# Altium schematic sheet Jellyfish - LCD.SchDoc
size A
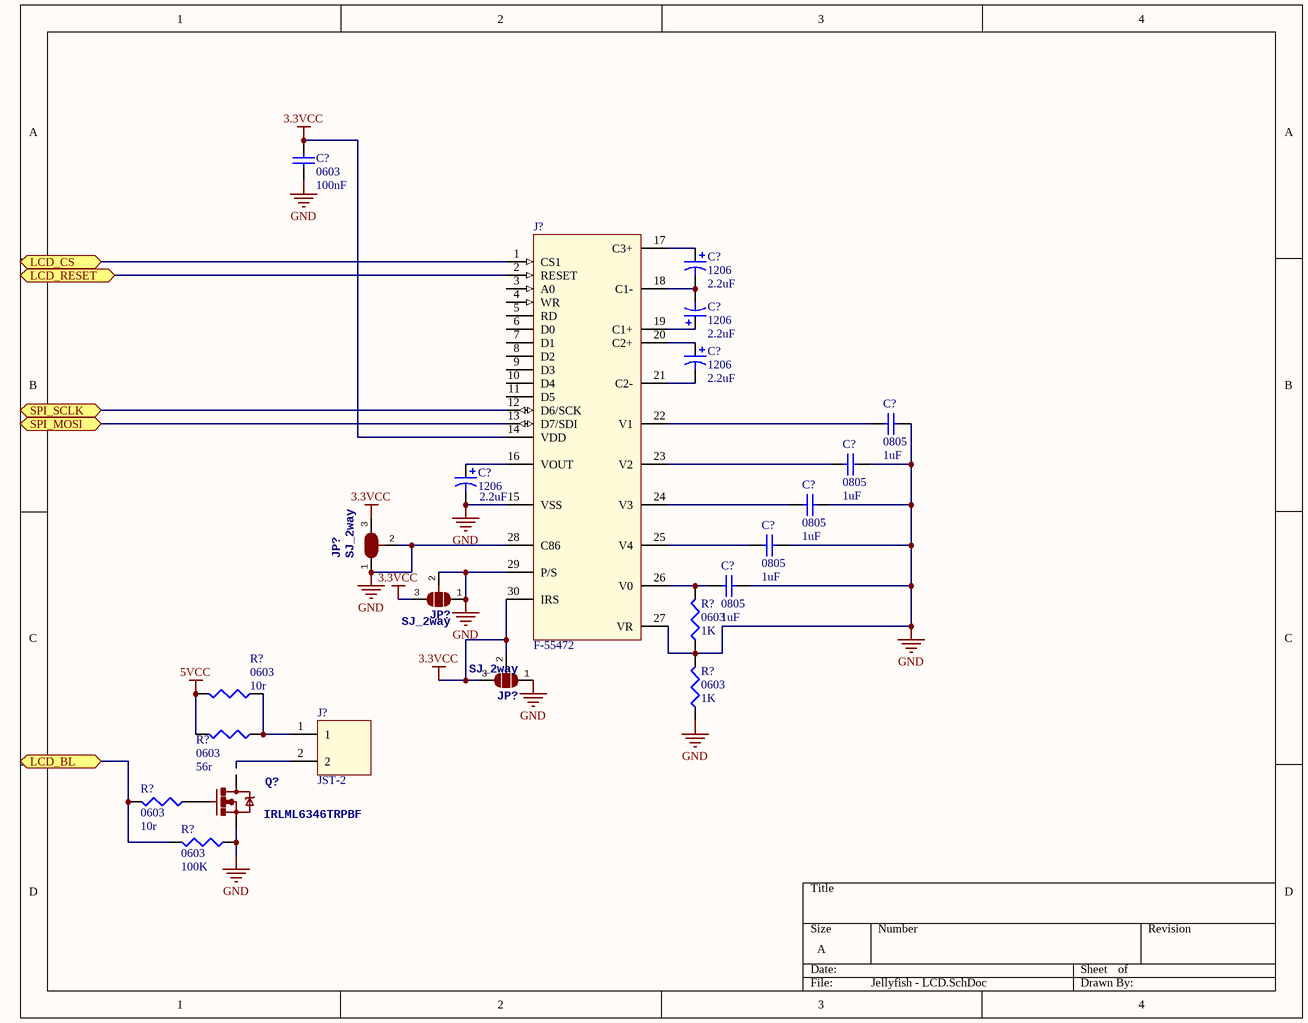
[diagram p0: Jellyfish - LCD.SchDoc]

## Parts
(Parts that share a designator on the sheet are numbered #1, #2 ... from top to bottom, then left to right.)
C?#1  0603  value 100nF  [1608[0603]]
C?#2  1206  value 2.2uF  [C1206Tantalum]
C?#3  1206  value 2.2uF  [C1206Tantalum]
C?#4  1206  value 2.2uF  [C1206Tantalum]
C?#5  0805  value 1uF  [SM 0805 - gap trimmed]
C?#6  0805  value 1uF  [SM 0805 - gap trimmed]
C?#7  1206  value 2.2uF  [C1206Tantalum]
C?#8  0805  value 1uF  [SM 0805 - gap trimmed]
C?#9  0805  value 1uF  [SM 0805 - gap trimmed]
C?#10  0805  value 1uF  [SM 0805 - gap trimmed]
J?#1  F-55472  [10051922-3010ELF]
J?#2  JST-2  [JST-2]
JP?#1  SJ_2way  [SJ-2way]
JP?#2  SJ_2way  [SJ-2way]
JP?#3  SJ_2way  [SJ-2way]
Q?  IRLML6346TRPBF  [SOT23-3]
R?#1  0603  value 1K  [J1-0603]
R?#2  0603  value 10r  [J1-0603]
R?#3  0603  value 1K  [J1-0603]
R?#4  0603  value 56r  [J1-0603]
R?#5  0603  value 10r  [J1-0603]
R?#6  0603  value 100K  [J1-0603]

## Ports
LCD_BL, LCD_CS, LCD_RESET, SPI_MOSI, SPI_SCLK

## Nets
3.3VCC: C?#1.2 J?#1.14(VDD) J?#1.30(IRS) JP?#1.3 JP?#2.3 JP?#3.2 JP?#3.3
5VCC: R?#2.2 R?#4.2
GND: C?#1.1 C?#5.2 C?#6.2 C?#7.2 C?#8.2 C?#9.2 C?#10.2 J?#1.15(VSS) J?#1.27(VR) J?#1.28(C86) J?#1.29(P/S) JP?#1.1 JP?#1.2 JP?#2.1 JP?#2.2 JP?#3.1 Q?.2(S) R?#1.1 R?#3.1 R?#3.2 R?#6.1
LCD_BL: R?#5.2 R?#6.2 ; port LCD_BL
LCD_CS: J?#1.1(CS1) ; port LCD_CS
LCD_RESET: J?#1.2(RESET) ; port LCD_RESET
SPI_MOSI: J?#1.13(D7/SDI) ; port SPI_MOSI
SPI_SCLK: J?#1.12(D6/SCK) ; port SPI_SCLK
NetC?#2_1: C?#2.1 J?#1.17(C3+)
NetC?#2_2: C?#2.2 C?#3.2 J?#1.18(C1-)
NetC?#3_1: C?#3.1 J?#1.19(C1+)
NetC?#4_1: C?#4.1 J?#1.20(C2+)
NetC?#4_2: C?#4.2 J?#1.21(C2-)
NetC?#5_1: C?#5.1 J?#1.22(V1)
NetC?#6_1: C?#6.1 J?#1.23(V2)
NetC?#7_1: C?#7.1 J?#1.16(VOUT)
NetC?#8_1: C?#8.1 J?#1.24(V3)
NetC?#9_1: C?#9.1 J?#1.25(V4)
NetC?#10_1: C?#10.1 J?#1.26(V0) R?#1.2
NetJ?#2_1: J?#2.1 R?#2.1 R?#4.1
NetQ?_1: Q?.1(G) R?#5.1

Not connected (* = marked no-connect by the designer): J?#1 3(A0) 4(WR) 5(RD) 6(D0) 7(D1) 8(D2) 9(D3) 10(D4) 11(D5); J?#2 2; Q? 3(D)

## Library data of the parts
C?#1 C?#5 C?#6 C?#8-C?#10 = Cap Semi: Capacitor (Semiconductor SIM Model); Published: 8-Jun-2000; LatestRevisionDate: 29-May-2009; LatestRevisionNote: IPC-7351 Footprint Added.; PackageReference: C1206; Publisher: Altium Limited; PackageDescription: Chip Capacitor
C?#2-C?#4 C?#7 = Cap Pol3: Polarized Capacitor (Surface Mount); Published: 8-Jun-2000; LatestRevisionDate: 29-May-2009; LatestRevisionNote: IPC-7351 Footprint Added.; PackageReference: C0805; Publisher: Altium Limited; PackageDescription: Chip Capacitor
JP?#1-JP?#3 = SJ_2way: SMD solder jumper; LastRevisionNote: ImportComponents; Published: 23-Apr-2014; Publisher: UltiMachine; LastRevisionDate: 23-Apr-2014
Q? = IRLML6346TRPBF: Mosfet N-Channel 30V 3.4A 63mOhm; LastRevisionNote: ImportComponents; LastRevisionDate: 23-Apr-2014; ManufacturerPartNumber: IRLML6346TRPBF; Published: 23-Apr-2014; Publisher: UltiMachine
R?#1-R?#6 = Res3: Resistor; Published: 8-Jun-2000; LatestRevisionDate: 29-May-2009; LatestRevisionNote: IPC-7351 Footprint Added.; PackageReference: J1-0603; Publisher: Altium Limited; PackageDescription: Chip Resistor